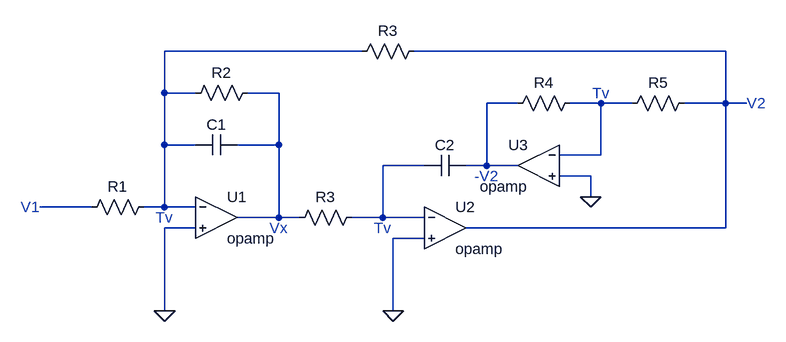
[diagram p0: schematic tarea2.asc]
tarea2.asc, the LTspice schematic file:
Version 4.1
SHEET 1 1008 680
WIRE 352 -96 48 -96
WIRE 912 -96 432 -96
WIRE 48 -32 48 -96
WIRE 96 -32 48 -32
WIRE 224 -32 176 -32
WIRE 592 -16 544 -16
WIRE 720 -16 672 -16
WIRE 768 -16 720 -16
WIRE 912 -16 912 -96
WIRE 912 -16 848 -16
WIRE 944 -16 912 -16
WIRE 48 48 48 -32
WIRE 96 48 48 48
WIRE 224 48 224 -32
WIRE 224 48 160 48
WIRE 720 64 720 -16
WIRE 720 64 656 64
WIRE 448 80 384 80
WIRE 544 80 544 -16
WIRE 544 80 512 80
WIRE 592 80 544 80
WIRE 704 96 656 96
WIRE 704 128 704 96
WIRE -64 144 -144 144
WIRE 48 144 48 48
WIRE 48 144 16 144
WIRE 96 144 48 144
WIRE 224 160 224 48
WIRE 224 160 160 160
WIRE 256 160 224 160
WIRE 384 160 384 80
WIRE 384 160 336 160
WIRE 448 160 384 160
WIRE 96 176 48 176
WIRE 912 176 912 -16
WIRE 912 176 512 176
WIRE 448 192 400 192
WIRE 48 304 48 176
WIRE 400 304 400 192
FLAG 48 304 0
FLAG 400 304 0
FLAG 704 128 0
SYMBOL OpAmps\\opamp 128 96 R0
SYMATTR InstName U1
SYMBOL res 32 128 R90
WINDOW 0 0 56 VBottom 2
WINDOW 3 32 56 VTop 2
SYMATTR InstName R1
SYMATTR Value ""
SYMBOL cap 160 32 R90
WINDOW 0 0 32 VBottom 2
WINDOW 3 32 32 VTop 2
SYMATTR InstName C1
SYMATTR Value ""
SYMBOL res 192 -48 R90
WINDOW 0 0 56 VBottom 2
WINDOW 3 32 56 VTop 2
SYMATTR InstName R2
SYMATTR Value ""
SYMBOL res 448 -112 R90
WINDOW 0 0 56 VBottom 2
WINDOW 3 32 56 VTop 2
SYMATTR InstName R3
SYMATTR Value ""
SYMBOL res 688 -32 R90
WINDOW 0 0 56 VBottom 2
WINDOW 3 32 56 VTop 2
SYMATTR InstName R4
SYMATTR Value ""
SYMBOL res 864 -32 R90
WINDOW 0 0 56 VBottom 2
WINDOW 3 32 56 VTop 2
SYMATTR InstName R5
SYMATTR Value ""
SYMBOL res 352 144 R90
WINDOW 0 0 56 VBottom 2
WINDOW 3 32 56 VTop 2
SYMATTR InstName R3
SYMATTR Value ""
SYMBOL OpAmps\\opamp 480 112 R0
SYMATTR InstName U2
SYMBOL cap 512 64 R90
WINDOW 0 0 32 VBottom 2
WINDOW 3 32 32 VTop 2
SYMATTR InstName C2
SYMATTR Value ""
SYMBOL OpAmps\\opamp 624 16 M0
SYMATTR InstName U3
TEXT -144 144 Right 2 ;V1
TEXT 944 -16 Left 2 ;V2
TEXT 224 160 Top 2 ;Vx
TEXT 544 80 Top 2 ;-V2
TEXT 48 144 Top 2 ;Tv
TEXT 384 160 Top 2 ;Tv
TEXT 720 -16 Bottom 2 ;Tv

The netlist it stands for:
* tarea2.asc
X§U1 N001 0 N003 opamp Aol=100K GBW=10Meg  ; pins invin noninvin out
R1 N001 N007
C1 N003 N001
R2 N003 N001
R3 N002 N001
R4 N005 N004
R5 N002 N005
R3 N006 N003
X§U2 N006 0 N002 opamp Aol=100K GBW=10Meg  ; pins invin noninvin out
C2 N004 N006
X§U3 N005 0 N004 opamp Aol=100K GBW=10Meg  ; pins invin noninvin out
* V1
* V2
* Vx
* -V2
* Tv
* Tv
* Tv
.backanno
.end